# Altium schematic sheet junction_cross.SchDoc
size A4
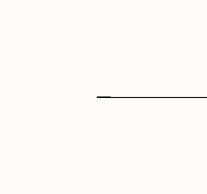
[diagram p0: junction_cross.SchDoc, top left]
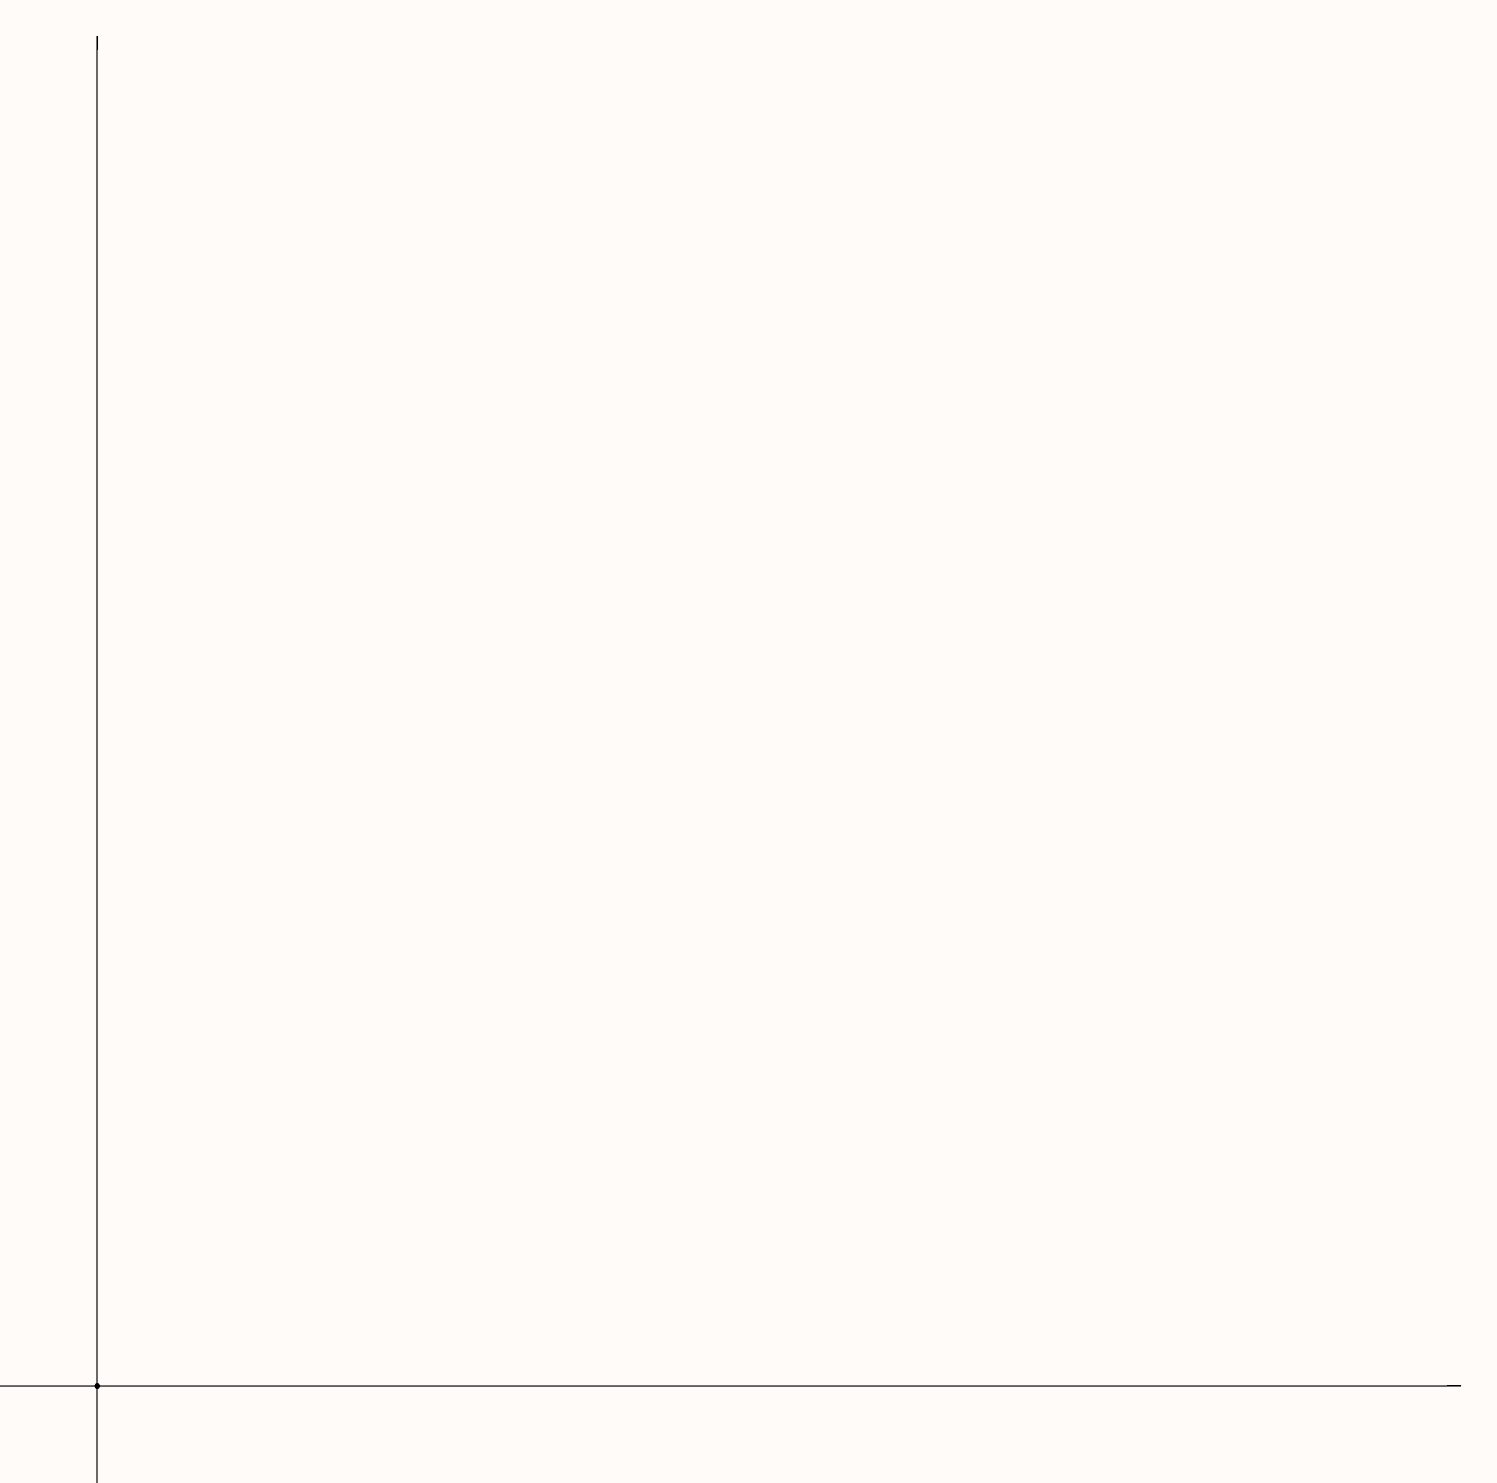
[diagram p1: junction_cross.SchDoc, top right]
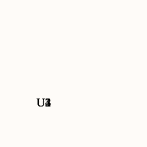
[diagram p2: junction_cross.SchDoc, bottom left]
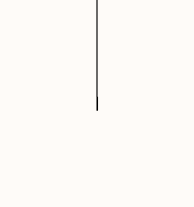
[diagram p3: junction_cross.SchDoc, bottom right]

## Parts
U1  (no value)
U2  (no value)
U3  (no value)
U4  (no value)

## Nets
NetU1_1: U1.1(A) U2.1(B) U3.1(C) U4.1(D)

## Library data of the parts
U1-U4 = DEVICE